# EAGLE design Crab_v3 (EAGLE 8.0.1)
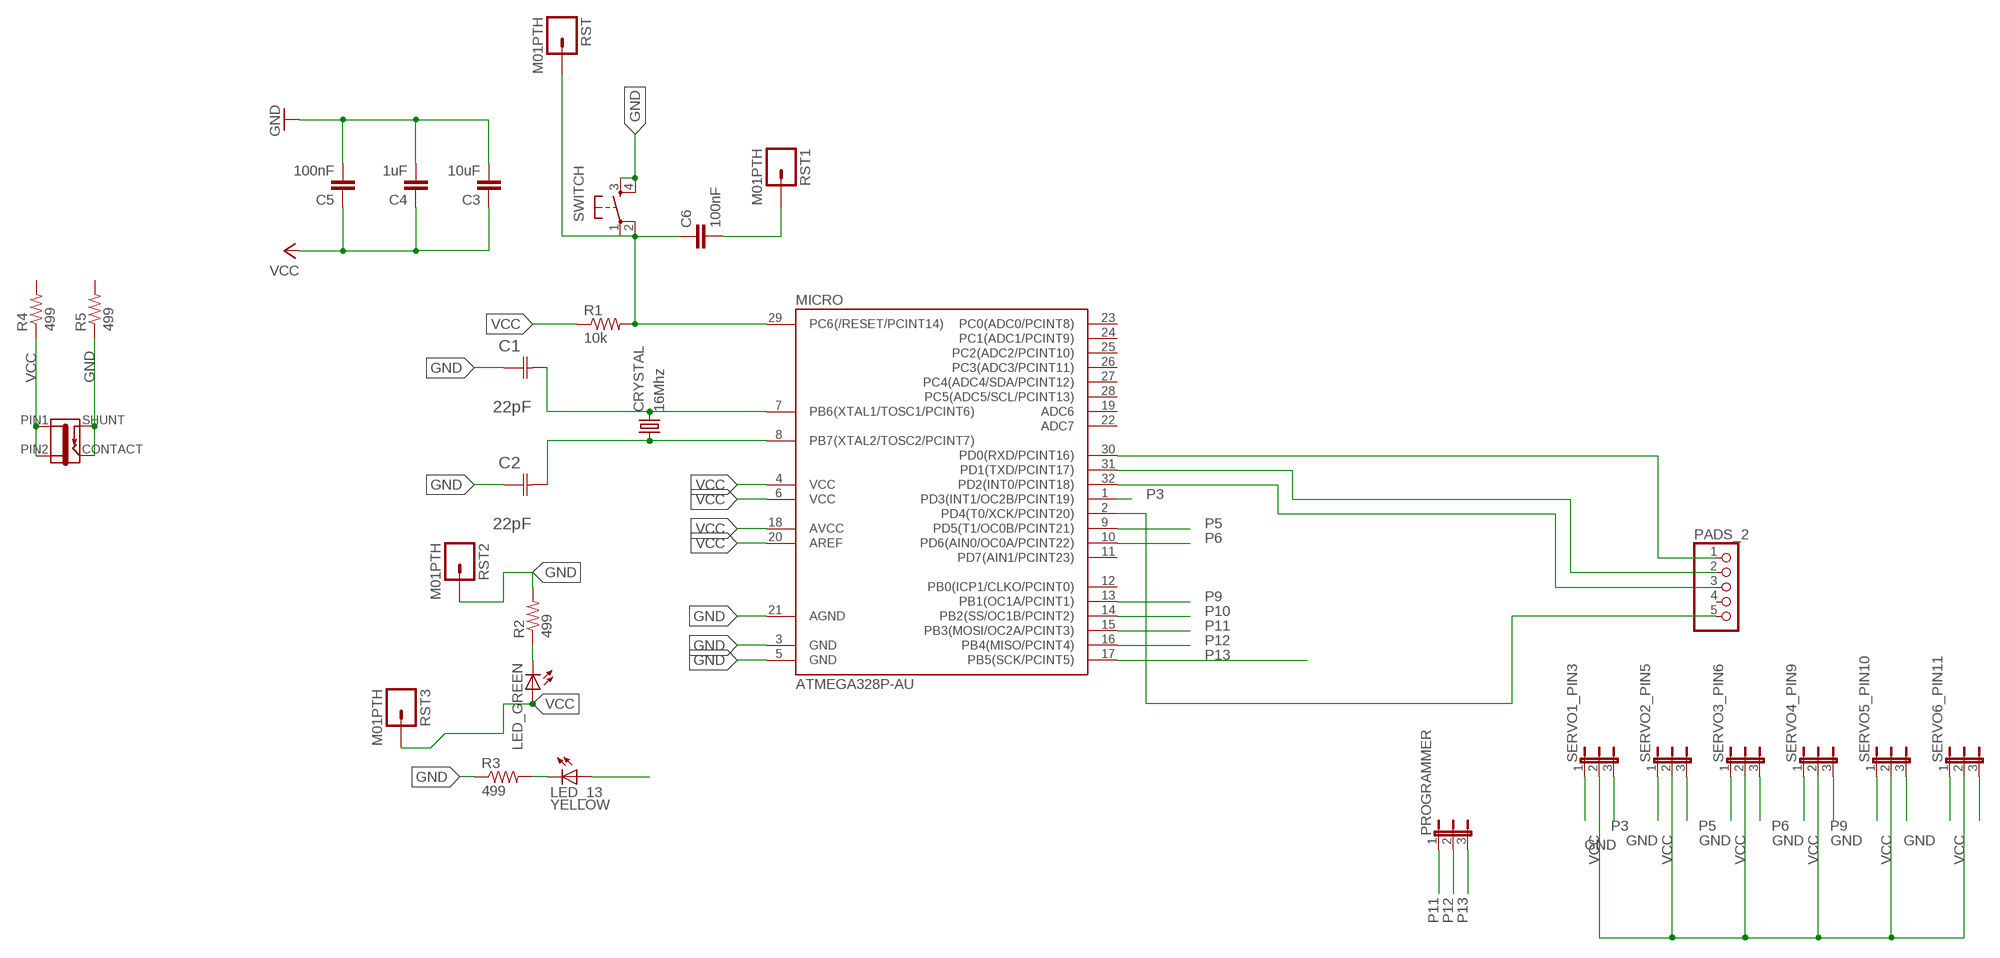
[diagram p0: schematic, sheet 1]

## Parts
C1  22pF  0612ZC225MAT2A  [CAPC3216X178N]
C2  22pF  0612ZC225MAT2A  [CAPC3216X178N]
C3  10uF  CAP1206  [1206]
C4  1uF  CAP1206  [1206]
C5  100nF  CAP1206  [1206]
C6  100nF  CAP1206  [1206]
CRYSTAL  16Mhz  CSM-7X-DU  [CSM-7X-DU]
J1  JACK-2.1MM  [PJ-002AH-SMT]
LED_13  YELLOW  LED1206  [1206]
LED_GREEN  LED1206  [1206]
MICRO  ATMEGA328P-AU  ATMEGA48/88/168-AU  [TQFP32-08]
PADS_2  PINHD-1X5  [1X05]
PROGRAMMER  JP2E  [JP2]
R1  10k  RESISTOR1206  [1206]
R2  499  RESISTOR1206  [1206]
R3  499  RESISTOR1206  [1206]
R4  499  RESISTOR1206  [1206]
R5  499  RESISTOR1206  [1206]
RST  M01PTH  [1X01]
RST1  M01PTH  [1X01]
RST2  M01PTH  [1X01]
RST3  M01PTH  [1X01]
SERVO1_PIN3  JP2E  [JP2]
SERVO2_PIN5  JP2E  [JP2]
SERVO3_PIN6  JP2E  [JP2]
SERVO4_PIN9  JP2E  [JP2]
SERVO5_PIN10  JP2E  [JP2]
SERVO6_PIN11  JP2E  [JP2]
SWITCH  6MM_SWITCH6MM_SWITCH  [6MM_SWITCH]

## Nets
GND: C1.1(C1) C2.1(C1) C3.2 C4.2 C5.2 J1.CONTACT J1.SHUNT MICRO.3(GND) MICRO.5(GND) MICRO.21(AGND) R2.2 R3.1 R5.1 RST2.1 SERVO1_PIN3.1 SERVO2_PIN5.1 SERVO3_PIN6.1 SERVO4_PIN9.1 SERVO5_PIN10.1 SERVO6_PIN11.1 SWITCH.3(S) SWITCH.4(S1)
N$2: C1.2(C2) CRYSTAL.2 MICRO.7(PB6(XTAL1/TOSC1/PCINT6))
N$3: C6.2 RST1.1
N$6: MICRO.30(PD0(RXD/PCINT16)) PADS_2.1
N$9: C2.2(C2) CRYSTAL.1 MICRO.8(PB7(XTAL2/TOSC2/PCINT7))
N$21: MICRO.31(PD1(TXD/PCINT17)) PADS_2.2
N$22: MICRO.32(PD2(INT0/PCINT18)) PADS_2.3
N$24: MICRO.2(PD4(T0/XCK/PCINT20)) PADS_2.5
N$26: LED_GREEN.2(C) R2.1
N$27: LED_13.2(C) R3.2
N$28: C6.1 MICRO.29(PC6(/RESET/PCINT14)) R1.2 RST.1 SWITCH.1(P) SWITCH.2(P1)
P3: LED_13.1(A) MICRO.1(PD3(INT1/OC2B/PCINT19)) SERVO1_PIN3.3
P5: MICRO.9(PD5(T1/OC0B/PCINT21)) SERVO2_PIN5.3
P6: MICRO.10(PD6(AIN0/OC0A/PCINT22)) SERVO3_PIN6.3
P9: MICRO.13(PB1(OC1A/PCINT1)) SERVO4_PIN9.3
P10: MICRO.14(PB2(SS/OC1B/PCINT2)) SERVO5_PIN10.3
P11: MICRO.15(PB3(MOSI/OC2A/PCINT3)) PROGRAMMER.1 SERVO6_PIN11.3
P12: MICRO.16(PB4(MISO/PCINT4)) PROGRAMMER.2
P13: MICRO.17(PB5(SCK/PCINT5)) PROGRAMMER.3
VCC: C3.1 C4.1 C5.1 J1.PIN1 J1.PIN2 LED_GREEN.1(A) MICRO.4(VCC) MICRO.6(VCC) MICRO.18(AVCC) MICRO.20(AREF) R1.1 R4.1 RST3.1 SERVO1_PIN3.2 SERVO2_PIN5.2 SERVO3_PIN6.2 SERVO4_PIN9.2 SERVO5_PIN10.2 SERVO6_PIN11.2
Unconnected: MICRO.11(PD7(AIN1/PCINT23)) MICRO.12(PB0(ICP1/CLKO/PCINT0)) MICRO.19(ADC6) MICRO.22(ADC7) MICRO.23(PC0(ADC0/PCINT8)) MICRO.24(PC1(ADC1/PCINT9)) MICRO.25(PC2(ADC2/PCINT10)) MICRO.26(PC3(ADC3/PCINT11)) MICRO.27(PC4(ADC4/SDA/PCINT12)) MICRO.28(PC5(ADC5/SCL/PCINT13)) PADS_2.4 R4.2 R5.2

## Library data of the parts
C1 C2 = AVX_By_element14_Batch_1:0612ZC225MAT2A: Capacitor 1206; MPN: 0612ZC225MAT2A; OC_FARNELL: -; OC_NEWARK: 12N3209; SUPPLIER: AVX; TOLERANCE: ±20%; VALUE: 2.2µF; VOLTAGERATING: 10V
C3-C6 = 01_SparkFun:CAP: Capacitor Standard 0603 ceramic capacitor, and 0.1" leaded capacitor.
CRYSTAL = 01_FAB_Hello:CSM-7X-DU: SMD CRYSTAL Source: www.ecsxtal.com .. Crystal 3.6864MHz CSM_7X_DU.PDF; OC_FARNELL: unknown; OC_NEWARK: unknown
J1 = fab:JACK-2.1MM: SMD DC power jack PJ-002AH-SMT As found in the fablab inventory. Made by Zaerc.
LED_13 LED_GREEN = 01_FAB_Hello:LED
MICRO = atmega8:ATMEGA48/88/168
PADS_2 = pinhead:PINHD-1X5: PIN HEADER
PROGRAMMER SERVO1_PIN3 SERVO2_PIN5 SERVO3_PIN6 SERVO4_PIN9 SERVO5_PIN10 SERVO6_PIN11 = jumper:JP2E: JUMPER
R1-R5 = 01_SparkFun:RESISTOR: Resistor Basic schematic elements and footprints for 0603, 1206, and PTH 1/10th watt (small) resistors.
RST RST1-RST3 = 01_SparkFun:M01: Header 1 Standard 1-pin 0.1" header. Use with straight break away headers (SKU : PRT-00116), right angle break away headers (PRT-00553), swiss pins (PRT-00743), machine pins (PRT-00117), and female headers (PRT-00115).
SWITCH = 01_FAB_Hello:6MM_SWITCH: OMRON SWITCH

## Board
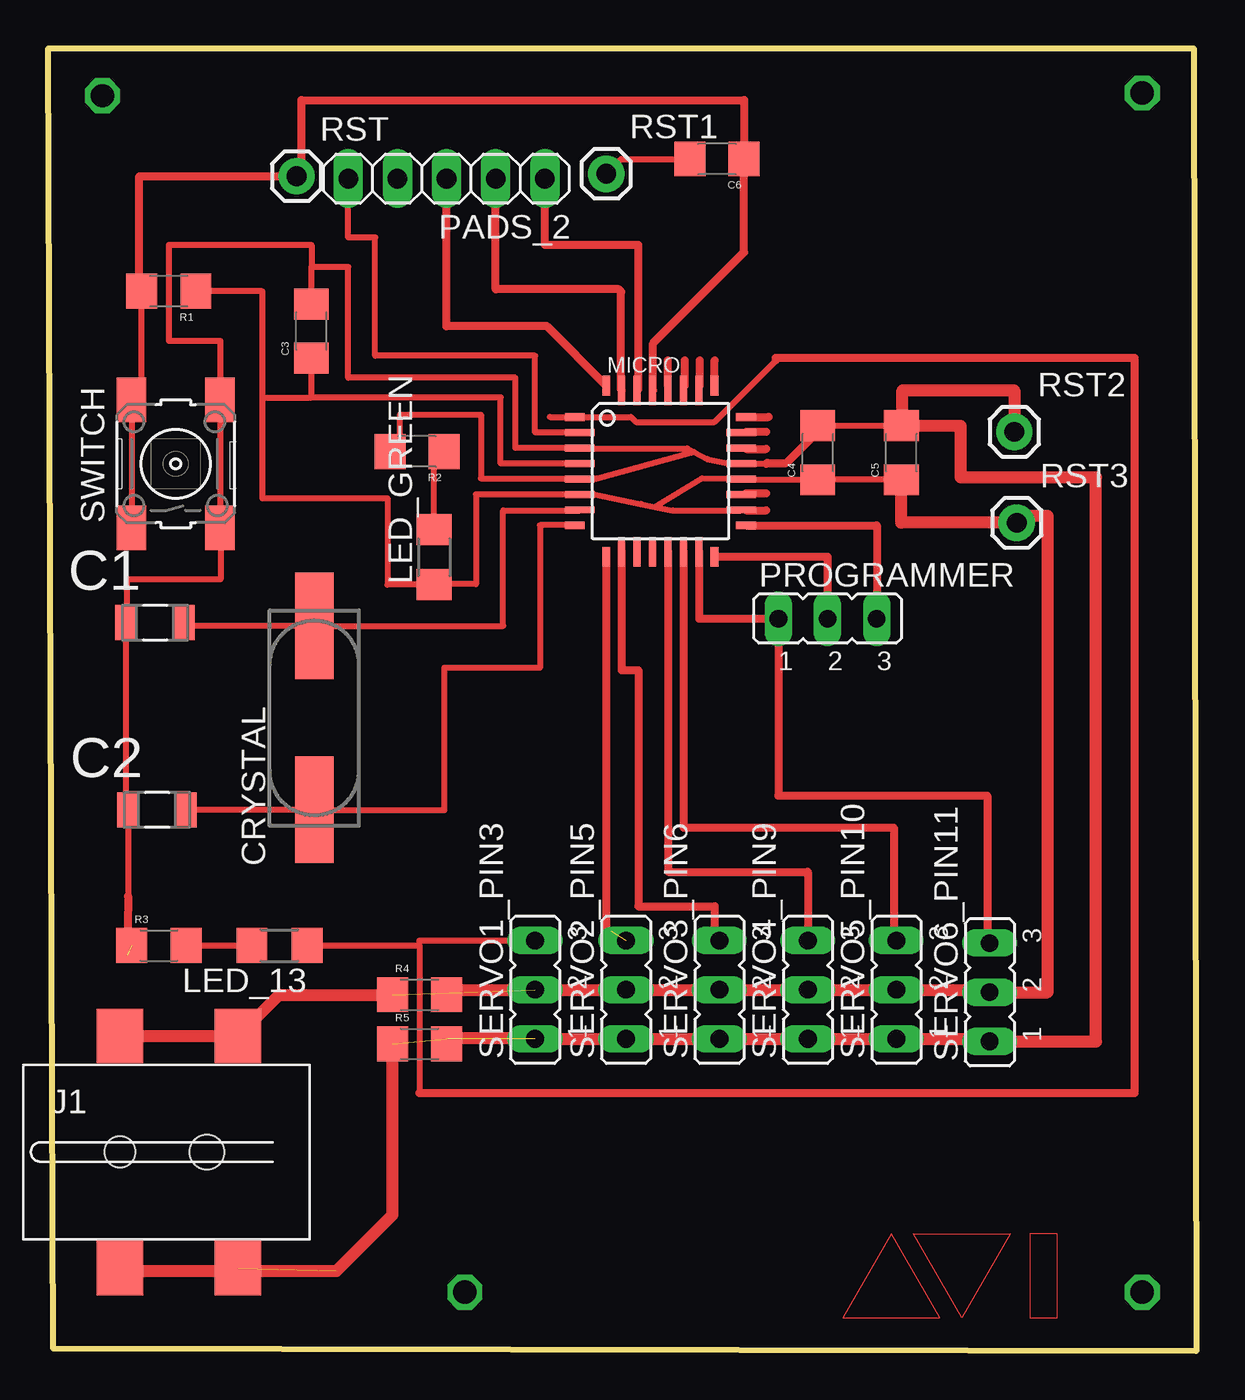
[diagram p1: board, top side]
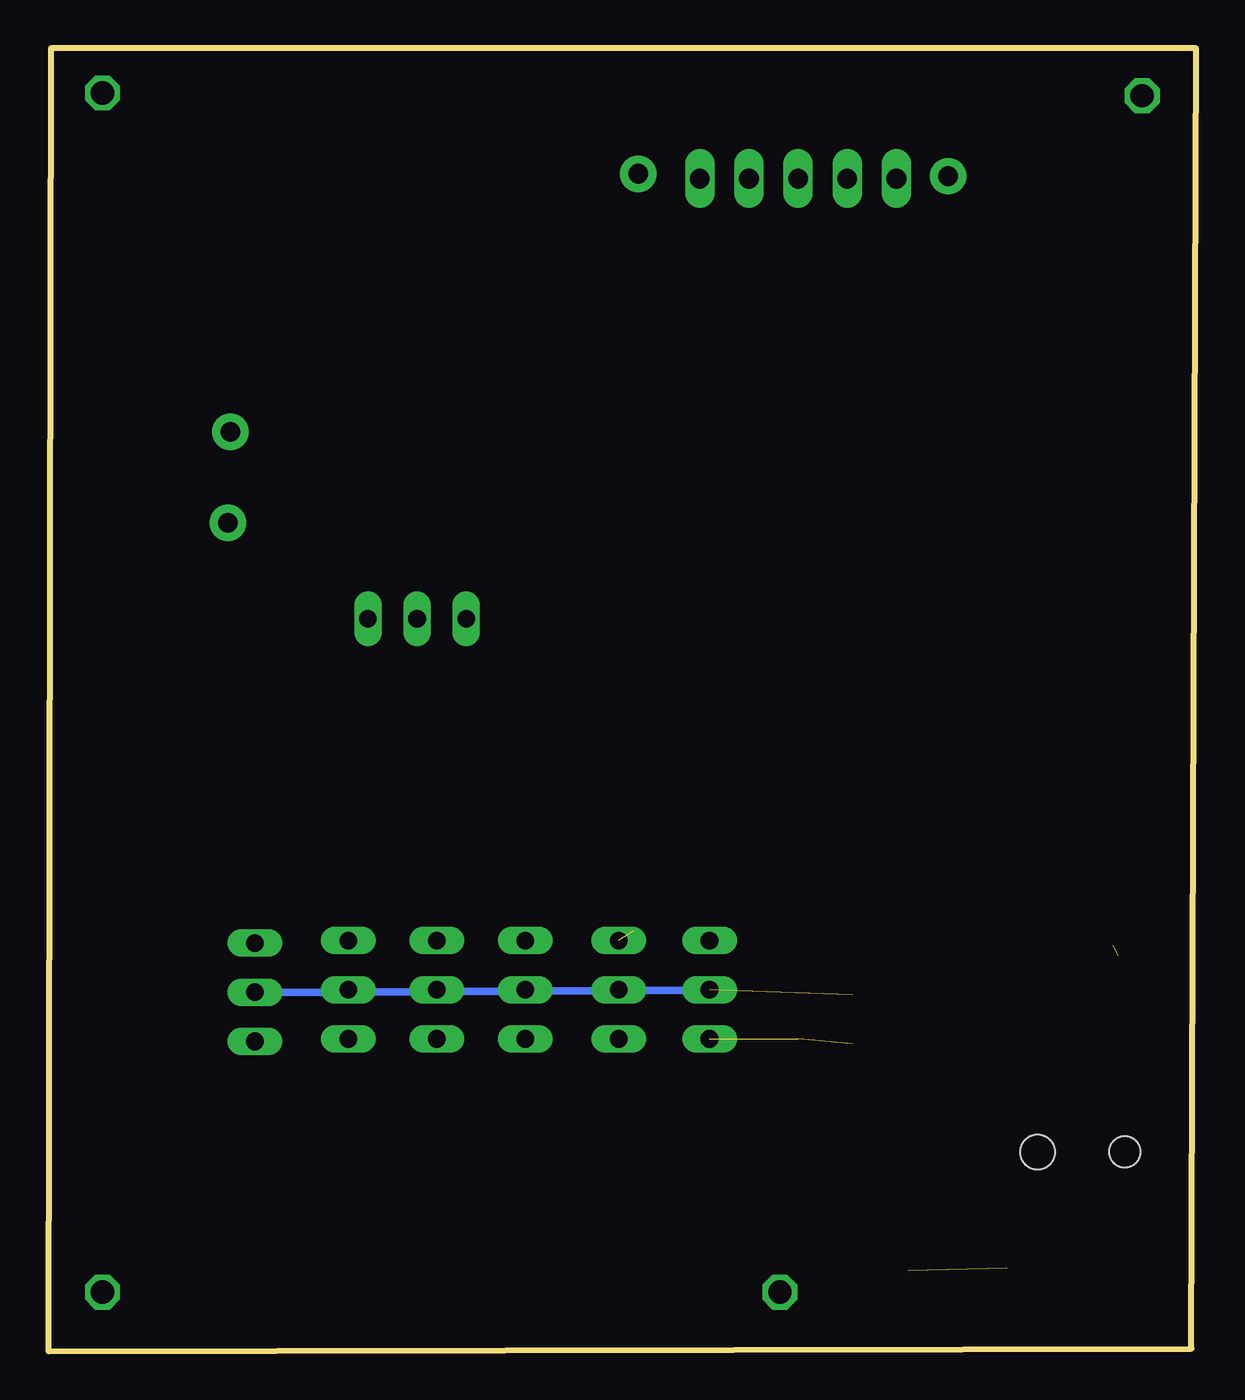
[diagram p2: board, bottom side, seen from below]

Size 59.31 x 67.31 mm. Coordinates in mm from the lower left corner, seen from the top.
Outline: 0,67.31 59.18,67.31 59.31,0 0.25,0.13 0,67.31
Copper layers (1*16): Top 0.035mm / dielectric 1.5mm / Bottom 0.035mm
Design rules "fab": minimum track width 0.3mm, minimum drill 32mil, track to track 0.315mm, track to pad 0.315mm, pad to pad 0.315mm, via to via 0.315mm, smd to smd 0.315mm, copper to edge 40mil, drill to drill 16mil, minimum pad ring 10mil, minimum via ring 8mil, stop-mask expansion 4mil, vias tented up to drill 0mil, thermal gap 10mil

### Footprints (pad centres in the part's own frame; a part is rotated, then mirrored left to right if it is on the bottom)
CAPC3216X178N = smd 1.118 x 1.803: 1 -1.499,0; 2 1.499,0
1206 = smd 1.6 x 1.8: 1 -1.4,0; 2 1.4,0
CSM-7X-DU = smd 5.5 x 2: 1 -4.75,0; 2 4.75,0
PJ-002AH-SMT = smd 2.4 x 2.8: CONTACT -2.4,-6; PIN1 3.7,6; PIN2 -2.4,6; SHUNT 3.7,-6 | hole 1.6: -2.4,0 | hole 1.8: 2.1,0
1206' = smd 1.6 x 1.803: 1 -1.422,0; 2 1.422,0
TQFP32-08 = smd 1.016 x 0.406: 1 -4.42,2.8; 8 -4.42,-2.8; 17 4.42,-2.8; 24 4.42,2.8 | smd 1.524 x 0.356: 2 -4.166,2; 3 -4.166,1.2; 4 -4.166,0.4; 5 -4.166,-0.4; 6 -4.166,-1.2; 7 -4.166,-2; 18 4.166,-2; 19 4.166,-1.2; 20 4.166,-0.4; 21 4.166,0.4; 22 4.166,1.2; 23 4.166,2 | smd 0.406 x 1.016: 9 -2.8,-4.42; 16 2.8,-4.42; 25 2.8,4.42; 32 -2.8,4.42 | smd 0.356 x 1.524: 10 -2,-4.166; 11 -1.2,-4.166; 12 -0.4,-4.166; 13 0.4,-4.166; 14 1.2,-4.166; 15 2,-4.166; 26 2,4.166; 27 1.2,4.166; 28 0.4,4.166; 29 -0.4,4.166; 30 -1.2,4.166; 31 -2,4.166
1X05 = drill 1.016 long: 1 -5.08,0; 2 -2.54,0; 3 0,0; 4 2.54,0; 5 5.08,0
JP2 = drill 0.914 long: 1 -2.54,0; 2 0,0; 3 2.54,0
1X01 = drill 1.016 pad 1.88: 1 0,0
6MM_SWITCH = smd 2.286 x 1.524: 1 -3.302,2.286; 2 3.302,2.286; 3 -3.302,-2.286; 4 3.302,-2.286

### Placement (x,y rotation side)
C1  5.51,37.64 0 top
C2  5.61,27.97 0 top
C3  13.59,52.7 90 top
C4  39.75,46.42 90 top
C5  44.07,46.42 90 top
C6  34.54,61.59 180 top
CRYSTAL  13.74,32.72 90 top
J1  6.1,10.29 0 top
LED_13  YELLOW  [1206']  11.94,20.96 180 top
LED_GREEN  [1206']  19.94,41.02 90 top
MICRO  31.62,45.47 0 top
PADS_2  20.57,60.58 180 top
PROGRAMMER  40.26,37.85 0 top
R1  6.22,54.76 180 top
R2  19.05,46.48 180 top
R3  5.71,20.96 0 top
R4  19.18,18.41 0 top
R5  19.18,15.88 0 top
RST  12.83,60.71 0 top
RST1  28.83,60.83 0 top
RST2  49.91,47.5 0 top
RST3  50.04,42.8 0 top
SERVO1_PIN3  25.15,18.67 90 top
SERVO2_PIN5  29.85,18.67 90 top
SERVO3_PIN6  34.67,18.67 90 top
SERVO4_PIN9  39.24,18.67 90 top
SERVO5_PIN10  43.81,18.67 90 top
SERVO6_PIN11  48.64,18.54 90 top
SWITCH  6.58,45.85 90 top

### Tracks (layer width: path | path; a pad name or v marks a point on that pad's centre or on a via)
GND  (4 unrouted)
  Top 0.305: MICRO.5 | MICRO.21 | C1.1 4.01,27.96 C2.1 4.11,23.5 | C1.1 3.94,37.64 | MICRO.5 27.46,45.09 22.35,45.09 22.35,48.39 18.16,48.39 18.16,46.36 R2.2 18.16,46.61 | C1.1 4.06,37.64 4.06,39.88 8.89,39.88 8.89,42.55 | MICRO.5 28.07,45.09 28.32,45.09 33.2,46.43 | MICRO.21 35.18,45.85 34.04,46.1 33.01,46.64 | 13.59,56.01 15.49,56.01 15.49,50.29 24.13,50.29 24.13,46.67 MICRO.3 27.48,46.64 33.01,46.64 | 33.2,46.43 33.33,46.47 | 33.01,46.64 33.2,46.43 | C3.2 13.59,56.01 | SWITCH.3 8.89,42.55 | 8.89,42.55 8.89,48.51 8.86,48.51 SWITCH.4 8.89,49.15 8.89,52.2 6.22,52.2 6.22,57.15 13.59,57.15 13.59,56.01 | MICRO.21 35.81,45.85 37.08,45.85 | 39.05,47.82 C4.2 C5.2 | C5.2 44.07,48.01 | 44.58,47.82 C5.2
  Top 0.406: 20.57,16.13 20.57,15.88 | 44.58,47.88 44.58,47.82 | 4.11,23.5 4.06,20.45 | 37.08,45.85 37.13,45.9 38.13,45.9 39.75,47.51 C4.2
  Top 0.61: RST2.1 49.91,49.65 44.13,49.65 44.13,47.82 C5.2 47.13,47.82 47.13,45.15 54.13,45.15 54.13,16 SERVO6_PIN11.1 48.64,16.13 SERVO5_PIN10.1 SERVO4_PIN9.1 SERVO3_PIN6.1 SERVO2_PIN5.1 SERVO1_PIN3.1 | J1.CONTACT 3.84,4.15 14.88,4.15 17.78,7.04 R5.1
N$1
  Top 0.001: 50.71,1.73 52.13,1.73 52.13,6.07 50.71,6.07 50.71,1.73
N$2
  Top 0.305: 7.01,37.47 C1.2 7.01,37.47 | MICRO.7 27.46,43.43 23.5,43.43 23.5,37.47 CRYSTAL.2 7.01,37.47
N$3
  Top 0.305: RST1.1 29.59,61.59 C6.2
N$4
  Top 0.001: 47.2,1.73 44.7,6.07 49.71,6.07 47.2,1.73
N$5
  Top 0.001: 43.56,6.07 41.06,1.73 46.07,1.73 43.56,6.07
N$6
  Top 0.406: MICRO.30 30.48,49.69 30.48,57.15 25.65,57.15 PADS_2.1
N$7  (via drill 1.2)
  other vias: 2.79,64.87
N$8  (via drill 1.2)
  other vias: 56.52,65.01
N$9
  Top 0.305: 7.11,27.94 C2.2 | MICRO.8 25.4,42.67 25.4,35.31 20.45,35.31 20.45,27.94 13.74,27.94 CRYSTAL.1 C2.2 | C2.2
N$10  (via drill 1.2)
  other vias: 56.52,3.05 21.51,3.05
N$11
  Top 0.406: 34.42,49.91 34.42,51.18
N$12
  Top 0.406: 33.66,49.91 33.66,51.18 | 32.89,49.91 32.89,51.18 | 32,49.91 32,51.18
N$13
  Top 0.406: 36.19,48.26 37.21,48.26 | 36.07,47.5 37.08,47.5 | 36.07,46.61 37.08,46.61 | 36.07,44.32 37.08,44.32 | 36.07,43.43 37.08,43.43
N$14
  Top 0.61: 25.13,18.65 20.63,18.65
N$15
  Top 0.61: 25.13,16.15 20.63,16.15
N$21
  Top 0.406: MICRO.31 29.59,49.66 29.59,54.74 29.46,54.86 23.11,54.86 PADS_2.2
N$22
  Top 0.305: MICRO.32
  Top 0.406: MICRO.32 25.78,52.93 25.78,52.96 20.57,52.96 PADS_2.3
N$24
  Top 0.305: MICRO.2 25.15,47.47 25.15,51.44 16.89,51.44 16.89,57.53 15.49,57.53 PADS_2.5
N$26
  Top 0.305: 20.83,46.23 R2.1 20.45,46.1 19.94,46.1 LED_GREEN.2
N$27
  Top 0.305: R3.2 LED_13.2
N$28
  Top 0.305: 31.24,49.63 MICRO.29 | 4.57,54.76 R1.2 | R1.2 4.82,49.15 SWITCH.2 SWITCH.1 | R1.2 4.57,55.01 | C6.1 36.07,61.59
  Top 0.406: MICRO.29 31.24,49.65 31.24,52.07 35.94,56.77 C6.1 35.94,64.64 13.08,64.64 13.08,60.71 RST.1 4.7,60.71 4.7,54.76 R1.2
P3
  Top 0.305: 25.91,48.26 MICRO.1 30.1,48.26 30.35,48.01 34.42,48.01 37.59,51.18 37.72,51.31 | SERVO1_PIN3.3 19.18,21.21 19.18,20.96 | 19.18,20.96 19.18,13.34 | LED_13.1 19.18,20.96
  Top 0.406: 19.18,13.34 56.13,13.34 56.13,51.31 37.59,51.31 37.59,51.18
P5  (1 unrouted)
  Top 0.406: 29.08,21.72 28.82,21.72 MICRO.9
P6
  Top 0.406: 34.16,21.21 SERVO3_PIN6.3 34.42,21.21 34.42,22.99 30.48,22.99 30.48,35.18 29.62,35.18 MICRO.10
P9
  Top 0.406: MICRO.13 32.02,24.77 39.24,24.77 SERVO4_PIN9.3
P10
  Top 0.406: MICRO.14 32.82,27.05 43.69,27.05 43.69,21.21 SERVO5_PIN10.3
P11
  Top 0.406: MICRO.15 33.62,37.85 PROGRAMMER.1 37.72,28.7 48.51,28.7 48.51,21.08 SERVO6_PIN11.3
P12
  Top 0.305: MICRO.16
  Top 0.406: MICRO.16 40.26,41.05 PROGRAMMER.2
P13
  Top 0.406: MICRO.17 42.8,42.67 PROGRAMMER.3
VCC  (1 unrouted)
  Top 0.305: MICRO.18 35.79,43.43 32.26,43.43 31.36,43.62 | MICRO.20 | MICRO.4 23.37,45.87 23.37,49.28 13.59,49.28 | 11.05,49.28 11.05,54.76 R1.1 | 11.05,49.28 11.05,44.07 17.53,44.07 17.53,39.6 LED_GREEN.1 19.94,39.62 22.1,39.62 22.1,44.27 MICRO.6 28.14,44.27 30.6,43.77 31.36,43.62 | 31.36,43.62 33.78,45.09 MICRO.20 | 11.05,49.28 13.59,49.28 | 13.59,49.28 C3.1 13.97,51.3 13.97,51.05 | MICRO.20 35.84,45.02 C4.1 C5.1
  Top 0.406: 3.7,16.26 J1.PIN2 | 9.83,16.26 J1.PIN1
  Top 0.61: SERVO1_PIN3.2 SERVO2_PIN5.2 SERVO3_PIN6.2 SERVO4_PIN9.2 SERVO5_PIN10.2 48.64,18.67 SERVO6_PIN11.2 51.63,18.54 51.63,43.15 50.04,43.15 RST3.1 44.07,42.8 C5.1 | J1.PIN2 J1.PIN1 11.92,18.41 R4.1
  Bottom 0.406: SERVO6_PIN11.2 SERVO1_PIN3.2